# EAGLE design avr8 (EAGLE 5.10)
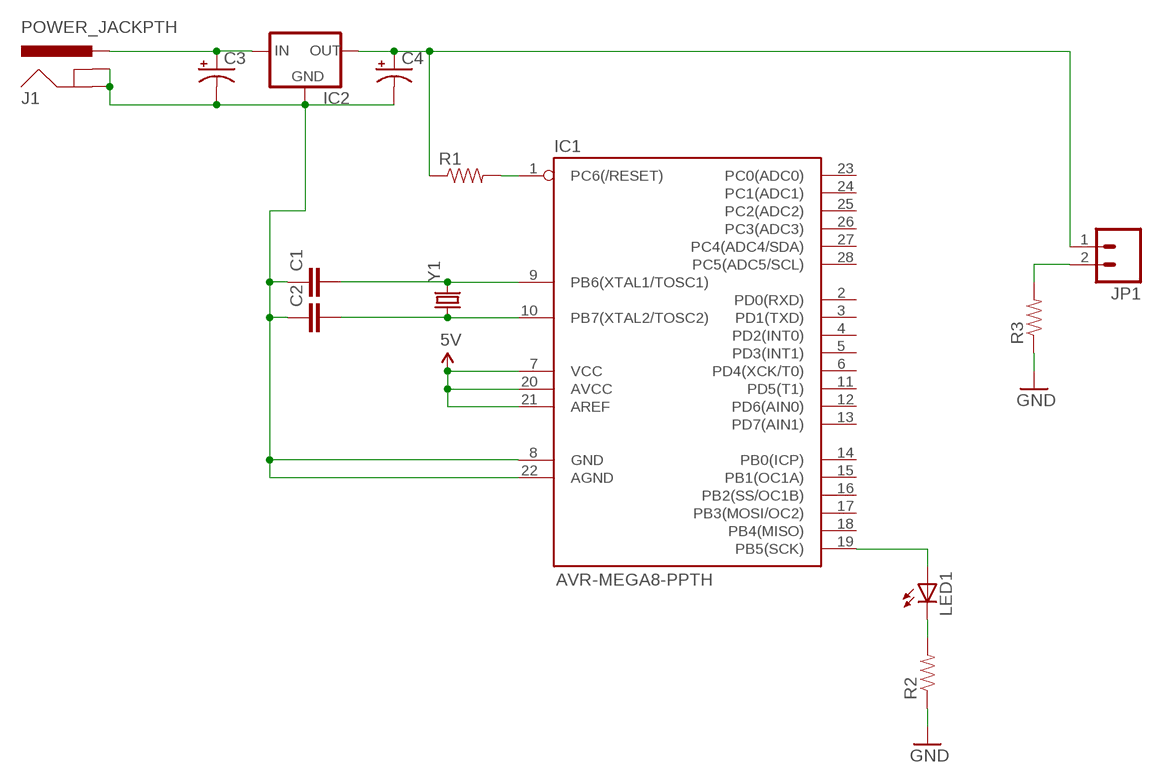
[diagram p0: schematic, sheet 1]

## Parts
C1  CAPPTH2  [CAP-PTH-SMALL2]
C2  CAPPTH2  [CAP-PTH-SMALL2]
C3  CAP_POLPTH2  [CPOL-RADIAL-10UF-25V]
C4  CAP_POLPTH2  [CPOL-RADIAL-10UF-25V]
IC1  AVR-MEGA8-PPTH  [DIL28-3]
IC2  V_REG_78XXSIDE  [78XXL]
J1  POWER_JACKPTH  [POWER_JACK_PTH]
JP1  M023.5MM  [SCREWTERMINAL-3.5MM-2]
LED1  LED5MM  [LED5MM]
R1  RESISTORAXIAL-0.3  [AXIAL-0.3]
R2  RESISTORAXIAL-0.3  [AXIAL-0.3]
R3  RESISTORAXIAL-0.3  [AXIAL-0.3]
Y1  CRYSTALHC49US  [HC49US]

## Nets
5V: C4.1(+) IC1.7(VCC) IC1.20(AVCC) IC1.21(AREF) IC2.OUT JP1.1 R1.P$1
GND: C1.1 C2.1 C3.2(-) C4.2(-) IC1.8(GND) IC1.22(AGND) IC2.GND J1.GND J1.GNDBREAK R2.P$1 R3.P$1
N$1: IC1.1(PC6(/RESET)) R1.P$2
N$2: C3.1(+) IC2.IN J1.PWR
N$3: JP1.2 R3.P$2
N$5: C2.2 IC1.10(PB7(XTAL2/TOSC2)) Y1.1
N$6: C1.2 IC1.9(PB6(XTAL1/TOSC1)) Y1.2
N$7: IC1.19(PB5(SCK)) LED1.A
N$8: LED1.K(C) R2.P$2
Unconnected: IC1.2(PD0(RXD)) IC1.3(PD1(TXD)) IC1.4(PD2(INT0)) IC1.5(PD3(INT1)) IC1.6(PD4(XCK/T0)) IC1.11(PD5(T1)) IC1.12(PD6(AIN0)) IC1.13(PD7(AIN1)) IC1.14(PB0(ICP)) IC1.15(PB1(OC1A)) IC1.16(PB2(SS/OC1B)) IC1.17(PB3(MOSI/OC2)) IC1.18(PB4(MISO)) IC1.23(PC0(ADC0)) IC1.24(PC1(ADC1)) IC1.25(PC2(ADC2)) IC1.26(PC3(ADC3)) IC1.27(PC4(ADC4/SDA)) IC1.28(PC5(ADC5/SCL))

## Library data of the parts
C1 C2 = SparkFun:CAP: Capacitor Standard 0603 ceramic capacitor, and 0.1" leaded capacitor.
C3 C4 = SparkFun:CAP_POL: Capacitor Polarized These are standard SMD and PTH capacitors. Normally 10uF, 47uF, and 100uF in electrolytic and tantalum varieties. Always verify the external diameter of the through hole cap, it varies with capacity, voltage, and manufacturer. The EIA devices should be standard.
IC1 = SparkFun:AVR-MEGA8-P: MICROCONTROLLER 8 Kbytes FLASH 1 kbytes SRAM 512 bytes EEPROM USART 4-channel 10 bit ADC 2-channel 8 bit ADC
IC2 = SparkFun:V_REG_78XX: Voltage Regulator Standard 7805 5V regulator. IGO (Input Ground Output). Spark Fun Electronics SKU : COM-00107
J1 = SparkFun:POWER_JACK: Power Jack This is the standard 5.5mm barrel jack for power. The PTH is the most common, proven, reliable, footprint. All others are experimental. The Slot footprint only works if the mill layer is transmitted to the PCB fab house so be warned. Spark Fun Electronics SKU : PRT-00119. Mating wall wart : TOL-00298 (and others)
JP1 = SparkFun:M02: Header 2 Standard 2-pin 0.1" header. Use with straight break away headers (SKU : PRT-00116), right angle break away headers (PRT-00553), swiss pins (PRT-00743), machine pins (PRT-00117), and female headers (PRT-00115). Molex polarized connector foot print use with SKU : PRT-08233 with associated crimp pins and housings.
LED1 = SparkFun:LED: LEDs Standard schematic elements and footprints for 5mm, 3mm, 1206, and 0603 sized LEDs. 5mm - Spark Fun Electronics SKU : COM-00529 (and others)
R1-R3 = SparkFun:RESISTOR: Resistor Basic schematic elements and footprints for 0603, 1206, and PTH resistors.
Y1 = SparkFun:CRYSTAL: Crystals Various standard crystals. Proven footprints. Spark Fun Electronics SKU : COM-00534

## Board
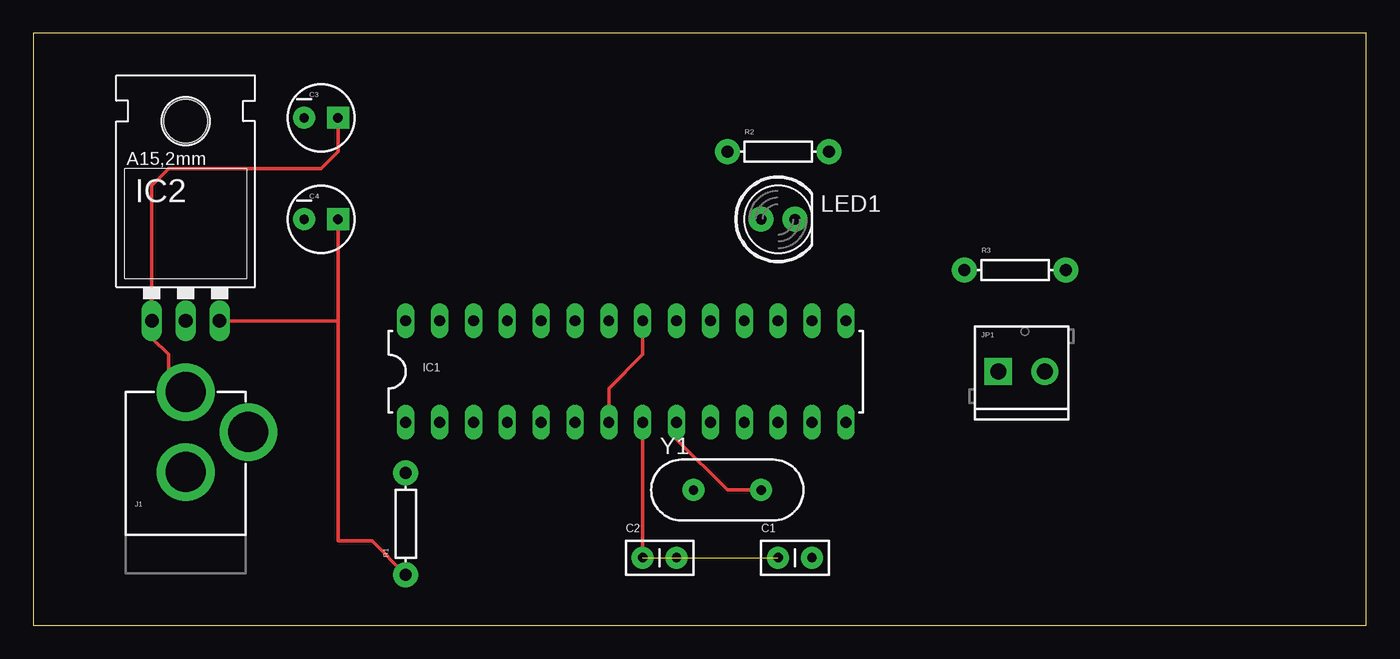
[diagram p1: board, top side]
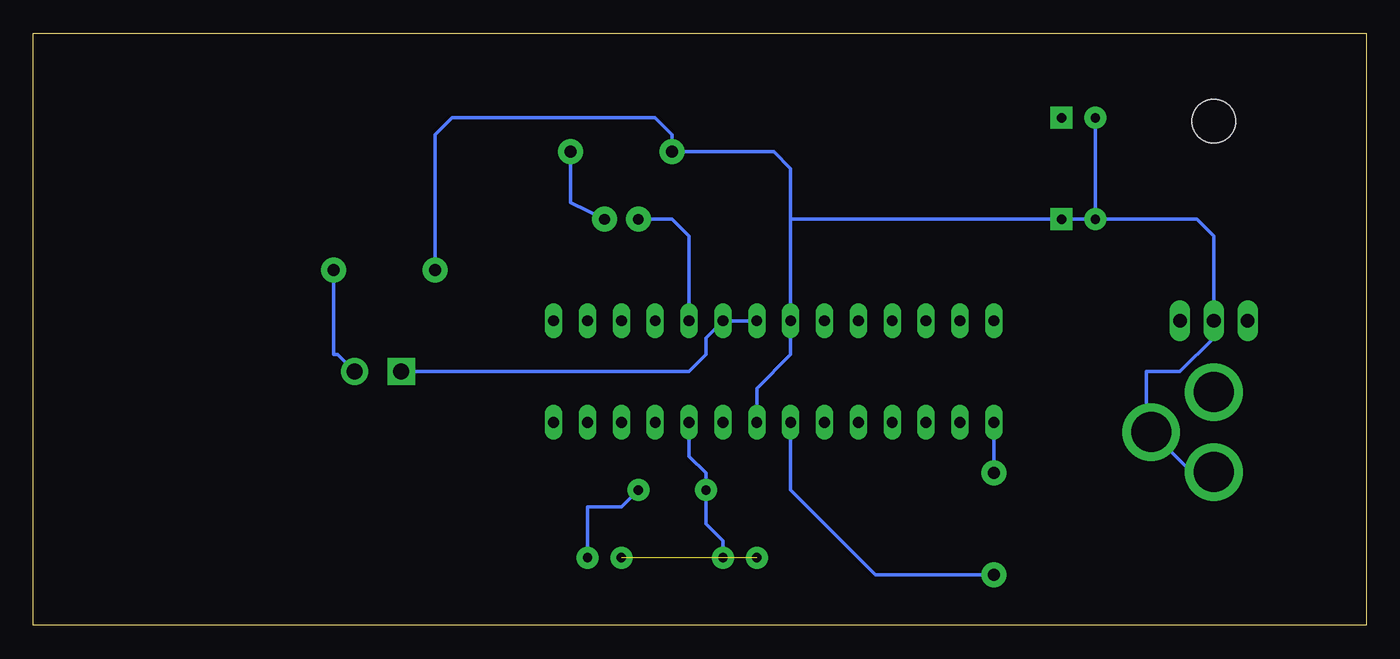
[diagram p2: board, bottom side, seen from below]

Size 100 x 44.44 mm. Coordinates in mm from the lower left corner, seen from the top.
Outline: 0,0 100,0 100,44.44 0,44.44 0,0
Copper layers (1*16): Top 0.035mm / dielectric 1.5mm / Bottom 0.035mm
Design rules "default": minimum track width 10mil, minimum drill 24mil, track to track 8mil, track to pad 8mil, pad to pad 8mil, via to via 8mil, smd to smd 8mil, copper to edge 40mil, drill to drill 8mil, minimum pad ring 10mil, minimum via ring 8mil, stop-mask expansion 4mil, vias tented up to drill 0mil, thermal gap 10mil

### Footprints (pad centres in the part's own frame; a part is rotated, then mirrored left to right if it is on the bottom)
CAP-PTH-SMALL2 = drill 0.7 pad 1.651 round: 1 0,0; 2 2.54,0
CPOL-RADIAL-10UF-25V = drill 0.7 pad 1.651 square: 1 1.27,0 | drill 0.7 pad 1.651 round: 2 -1.27,0
DIL28-3 = drill 0.813 long: 1 -16.51,-3.81; 2 -13.97,-3.81; 3 -11.43,-3.81; 4 -8.89,-3.81; 5 -6.35,-3.81; 6 -3.81,-3.81; 7 -1.27,-3.81; 8 1.27,-3.81; 9 3.81,-3.81; 10 6.35,-3.81; 11 8.89,-3.81; 12 11.43,-3.81; 13 13.97,-3.81; 14 16.51,-3.81; 15 16.51,3.81; 16 13.97,3.81; 17 11.43,3.81; 18 8.89,3.81; 19 6.35,3.81; 20 3.81,3.81; 21 1.27,3.81; 22 -1.27,3.81; 23 -3.81,3.81; 24 -6.35,3.81; 25 -8.89,3.81; 26 -11.43,3.81; 27 -13.97,3.81; 28 -16.51,3.81
78XXL = drill 1.016 long: GND 0,-3.81; IN -2.54,-3.81; OUT 2.54,-3.81 | hole 3.302: 0,11.176
POWER_JACK_PTH = drill 2.997 pad 4.318 round: GND 0,7.7; GNDBREAK 4.7,10.7; PWR 0,13.7
SCREWTERMINAL-3.5MM-2 = drill 1.2 pad 2.032 square: 1 0,0 | drill 1.2 pad 2.032 round: 2 3.5,0
LED5MM = drill 0.813 pad 1.88 round: A -1.27,0; K 1.27,0
AXIAL-0.3 = drill 0.9 pad 1.88 round: P$1 -3.81,0; P$2 3.81,0
HC49US = drill 0.7 pad 1.651 round: 1 -2.54,0; 2 2.54,0

### Placement (x,y rotation side)
C1  55.88,5.08 0 top
C2  45.72,5.08 0 top
C3  21.59,38.1 0 top
C4  21.59,30.48 0 top
IC1  44.45,19.05 0 top
IC2  11.43,26.67 0 top
J1  11.43,3.81 0 top
JP1  72.39,19.05 0 top
LED1  55.88,30.48 0 top
R1  27.94,7.62 90 top
R2  55.88,35.56 0 top
R3  73.66,26.67 0 top
Y1  52.07,10.16 0 top

### Tracks (layer width: path | path; a pad name or v marks a point on that pad's centre or on a via)
5V
  Top 0.254: 22.86,22.86 IC2.OUT | 22.86,22.86 C4.1 | 22.86,22.86 22.86,6.35 25.4,6.35 R1.P$1 | IC1.7 43.18,17.78 45.72,20.32 IC1.21
  Bottom 0.254: JP1.1 50.8,19.05 49.53,20.32 49.53,21.59 IC1.20 IC1.21 | IC1.7 43.18,10.16 36.83,3.81 R1.P$1
GND  (1 unrouted)
  Top 0.254: IC1.8 C2.1
  Bottom 0.254: C4.2 C3.2 | C4.2 12.7,30.48 11.43,29.21 IC2.GND 11.43,21.59 13.97,19.05 16.51,19.05 16.51,14.89 J1.GNDBREAK 13.05,11.43 11.43,11.43 J1.GND | 43.18,30.48 IC1.22 43.18,20.32 45.72,17.78 IC1.8 | 43.18,30.48 43.18,34.29 44.45,35.56 R2.P$1 52.07,36.83 53.34,38.1 68.58,38.1 69.85,36.83 R3.P$1 | C4.2 43.18,30.48
N$1
  Bottom 0.254: R1.P$2 IC1.1
N$2
  Top 0.254: C3.1 22.86,35.56 21.59,34.29 10.16,34.29 8.89,33.02 IC2.IN 8.89,21.59 10.16,20.32 10.16,18.78 J1.PWR
N$3
  Bottom 0.254: R3.P$2 77.47,20.32 77.16,20.32 JP1.2
N$5
  Bottom 0.254: C2.2 48.26,6.35 49.53,7.62 Y1.1 49.53,11.43 50.8,12.7 IC1.10
N$6
  Top 0.254: IC1.9 48.26,13.97 52.07,10.16 Y1.2
  Bottom 0.254: C1.2 58.42,8.89 55.88,8.89 Y1.2
N$7
  Bottom 0.254: LED1.A 52.07,30.48 50.8,29.21 IC1.19
N$8
  Bottom 0.254: R2.P$2 59.69,31.75 LED1.K